# Altium schematic sheet Headstage_withFPGA_BGA.SchDoc
size D
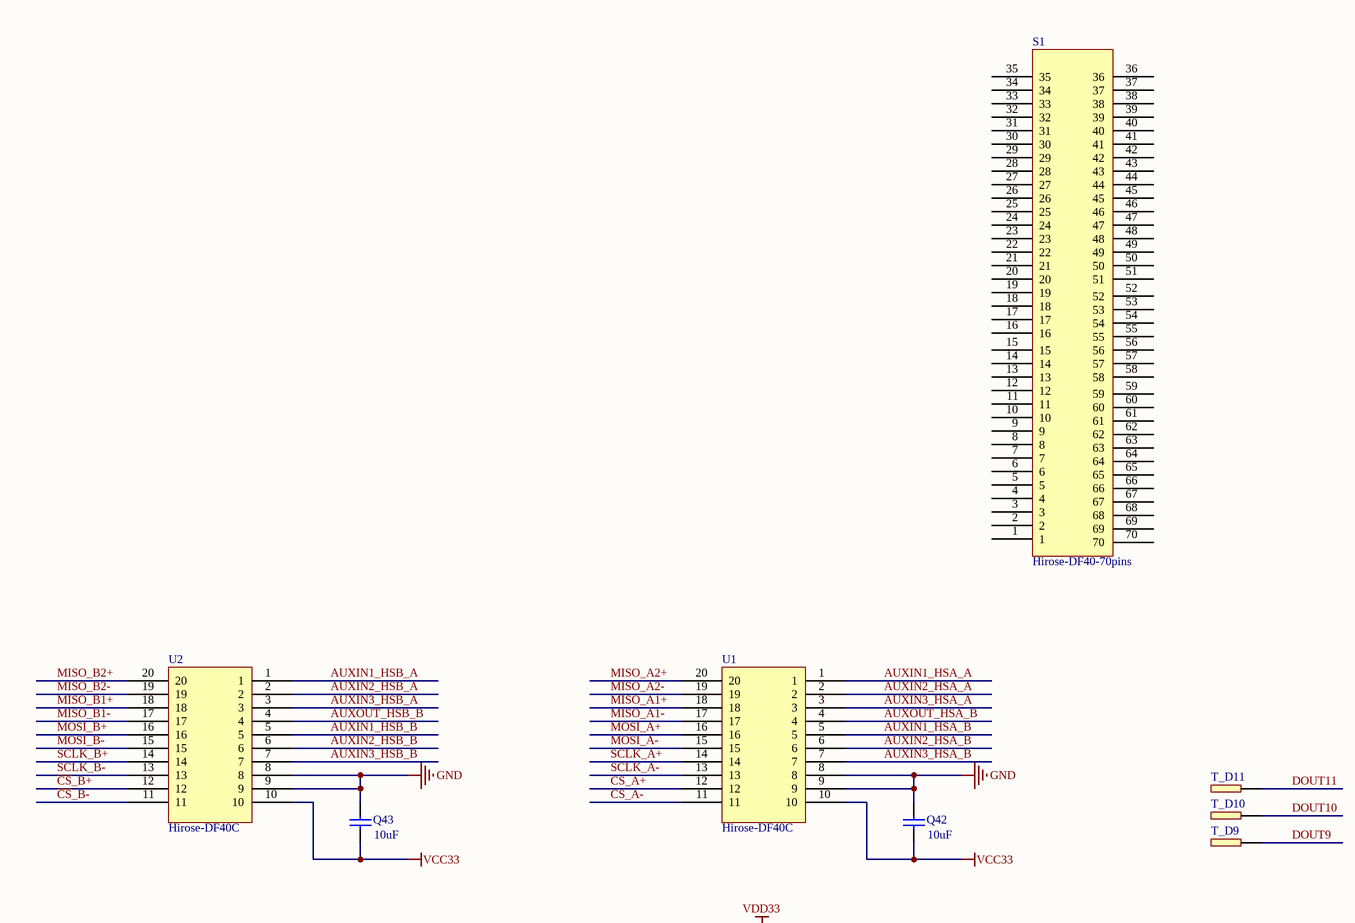
[diagram p0: Headstage_withFPGA_BGA.SchDoc, top left]
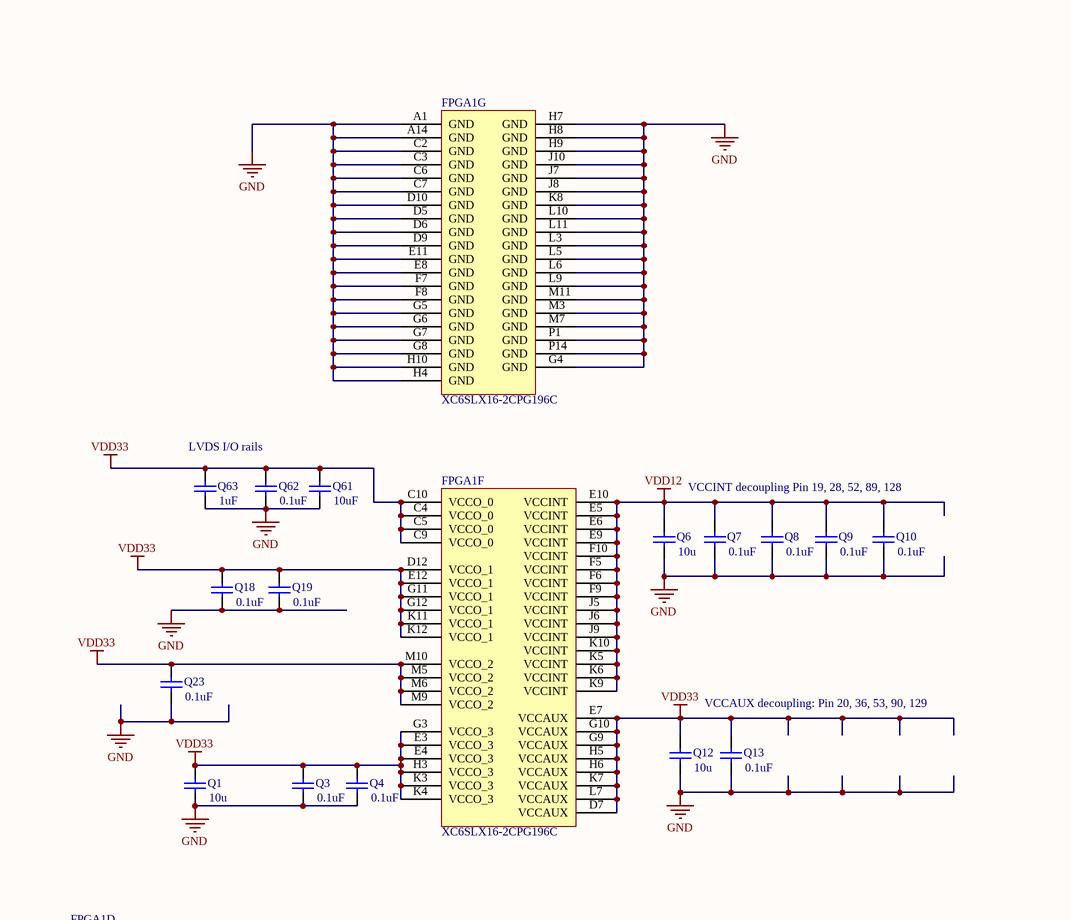
[diagram p1: Headstage_withFPGA_BGA.SchDoc, top right]
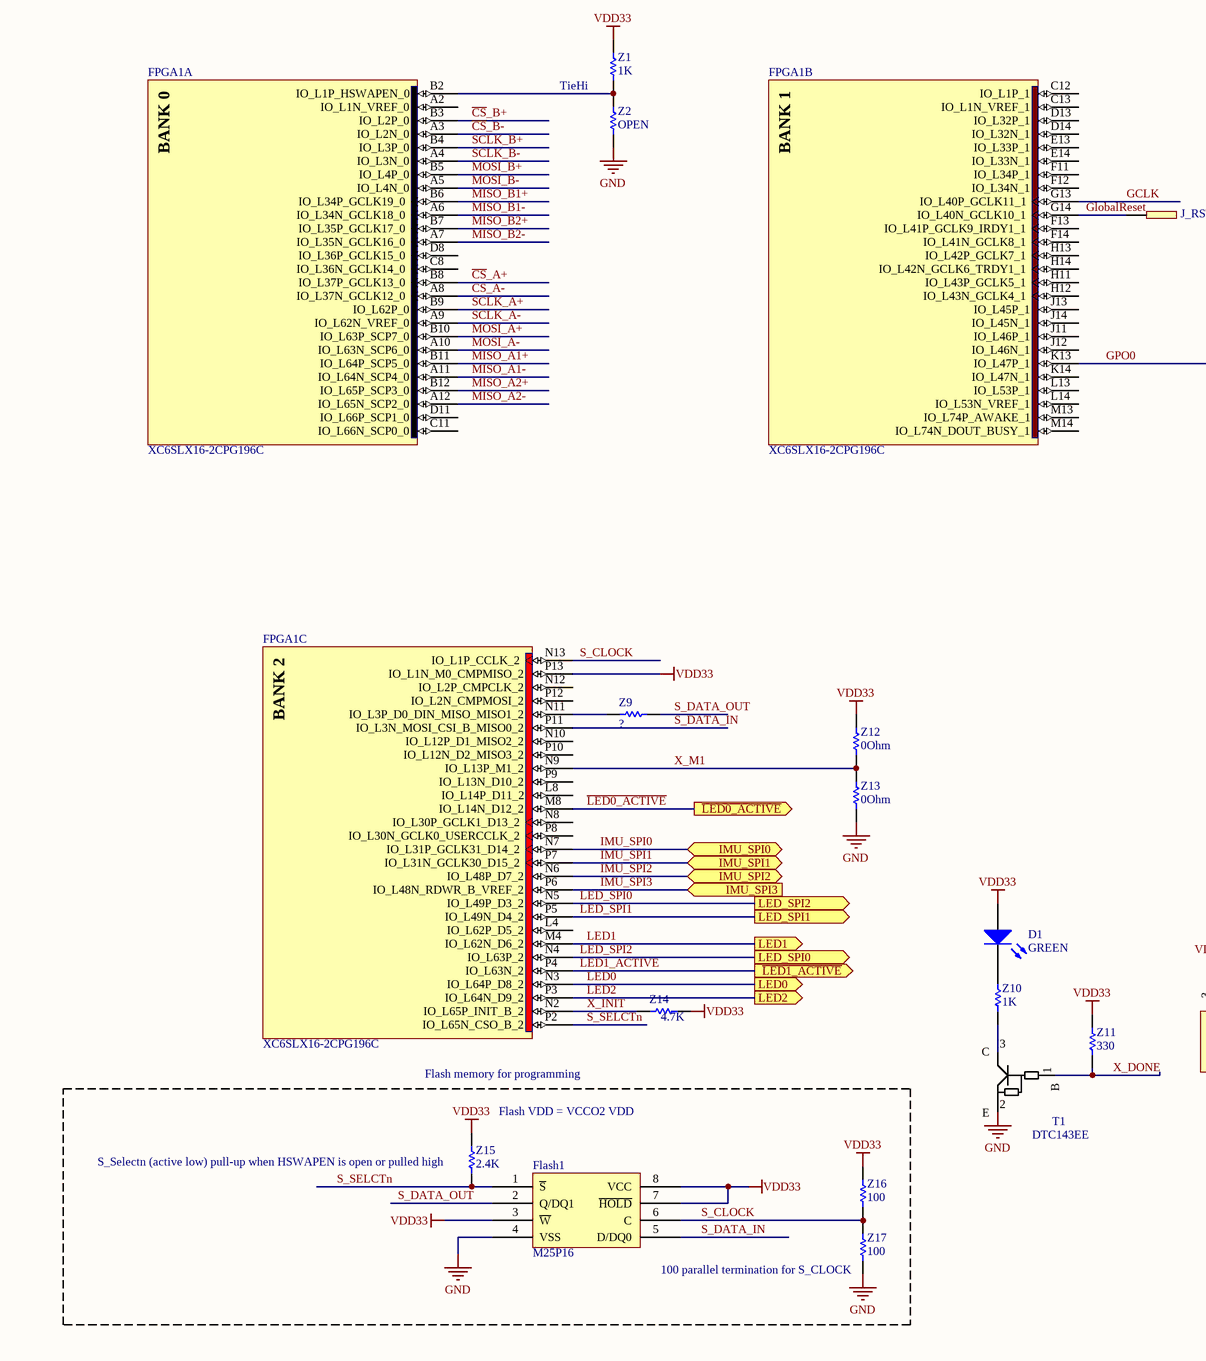
[diagram p2: Headstage_withFPGA_BGA.SchDoc, bottom left]
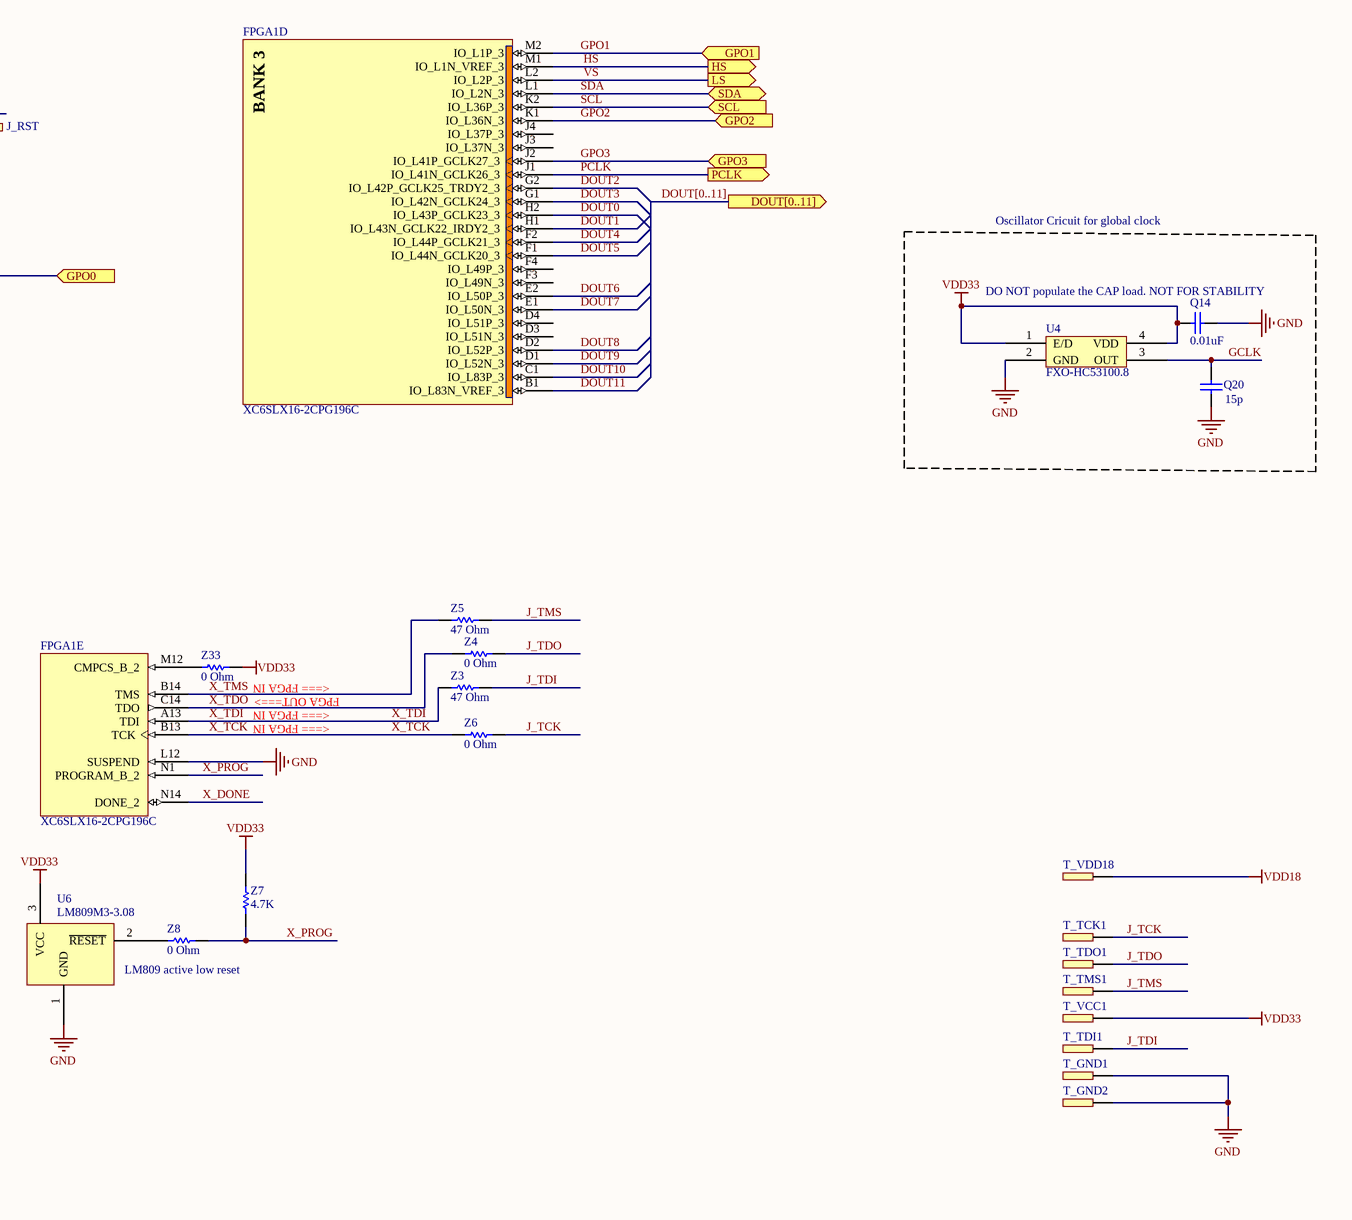
[diagram p3: Headstage_withFPGA_BGA.SchDoc, bottom right]

## Parts
D1  GREEN  [RES_0603]
Flash1  M25P16  [M25P16-S08N]
FPGA1  XC6SLX16-2CPG196C  [CPG196]  (parts A,B,C,D,E,F,G of 7)
J_RST  Header_1PIN  [JUMPER1PIN]  (value not drawn)
Q1  value 10u  [Cap-0603]  (hidden comment: X7R Ceramic)
Q3  value 0.1uF  [Cap_0402]  (hidden comment: X7R Ceramic)
Q4  value 0.1uF  [Cap_0402]  (hidden comment: X7R Ceramic)
Q6  value 10u  [Cap-0603]  (hidden comment: X7R Ceramic)
Q7  value 0.1uF  [Cap_0402]  (hidden comment: X7R Ceramic)
Q8  value 0.1uF  [Cap_0402]  (hidden comment: X7R Ceramic)
Q9  value 0.1uF  [Cap_0402]  (hidden comment: X7R Ceramic)
Q10  value 0.1uF  [Cap_0402]  (hidden comment: X7R Ceramic)
Q12  value 10u  [Cap-0603]  (hidden comment: X7R Ceramic)
Q13  value 0.1uF  [Cap_0402]  (hidden comment: X7R Ceramic)
Q14  value 0.01uF  [Cap_0402]  (hidden comment: X7R Ceramic)
Q18  value 0.1uF  [Cap_0402]  (hidden comment: X7R Ceramic)
Q19  value 0.1uF  [Cap_0402]  (hidden comment: X7R Ceramic)
Q20  value 15p  [Cap-0603]  (hidden comment: X7R Ceramic)
Q23  value 0.1uF  [Cap_0402]  (hidden comment: X7R Ceramic)
Q42  value 10uF  [Cap_0402]  (hidden comment: X7R Ceramic)
Q43  value 10uF  [Cap_0402]  (hidden comment: X7R Ceramic)
Q61  value 10uF  [Cap-0603]  (hidden comment: X7R Ceramic)
Q62  value 0.1uF  [Cap_0402]  (hidden comment: X7R Ceramic)
Q63  value 1uF  [Cap_0402]  (hidden comment: X7R Ceramic)
S1  Hirose-DF40-70pins  [DF40 - 70]
T1  DTC143EE  [VMT3]
T_D9  Header_1PIN  [JUMPER1PIN]  (value not drawn)
T_D10  Header_1PIN  [JUMPER1PIN]  (value not drawn)
T_D11  Header_1PIN  [JUMPER1PIN]  (value not drawn)
T_GND1  Header_1PIN  [JUMPER1PIN]  (value not drawn)
T_GND2  Header_1PIN  [JUMPER1PIN]  (value not drawn)
T_TCK1  Header_1PIN  [JUMPER1PIN]  (value not drawn)
T_TDI1  Header_1PIN  [JUMPER1PIN]  (value not drawn)
T_TDO1  Header_1PIN  [JUMPER1PIN]  (value not drawn)
T_TMS1  Header_1PIN  [JUMPER1PIN]  (value not drawn)
T_VCC1  Header_1PIN  [JUMPER1PIN]  (value not drawn)
T_VDD18  Header_1PIN  [JUMPER1PIN]  (value not drawn)
U1  Hirose-DF40C  [DF40]
U2  Hirose-DF40C  [DF40]
U4  FXO-HC53100.8  [FXO-HC53]
U6  LM809M3-3.08  [SOT23]
Z1  value 1K  [Res_0402]  (hidden comment: Res1)
Z2  value OPEN  [Res_0402]  (hidden comment: Res1)
Z3  value 47 Ohm  [Res_0402]  (hidden comment: Res1)
Z4  value 0 Ohm  [Res_0402]  (hidden comment: Res1)
Z5  value 47 Ohm  [Res_0402]  (hidden comment: Res1)
Z6  value 0 Ohm  [Res_0402]  (hidden comment: Res1)
Z7  value 4.7K  [Res_0402]  (hidden comment: Res1)
Z8  value 0 Ohm  [Res_0402]  (hidden comment: Res1)
Z9  Res1  [Res_0402]  (value not drawn)
Z10  value 1K  [Res_0402]  (hidden comment: Res1)
Z11  value 330  [Res_0402]  (hidden comment: Res1)
Z12  value 0Ohm  [Res_0402]  (hidden comment: Res1)
Z13  value 0Ohm  [Res_0402]  (hidden comment: Res1)
Z14  value 4.7K  [Res_0402]  (hidden comment: Res1)
Z15  value 2.4K  [Res_0402]  (hidden comment: Res1)
Z16  value 100  [Res_0402]  (hidden comment: Res1)
Z17  value 100  [Res_0402]  (hidden comment: Res1)
Z33  value 0 Ohm  [Res_0402]  (hidden comment: Res1)

## Ports
DOUT[0..11] (out), GPO0 (in), GPO1 (in), GPO2 (in), GPO3 (in), HS (out), IMU_SPI0 (bidir), IMU_SPI1 (bidir), IMU_SPI2 (bidir), IMU_SPI3 (in), LED0 (out), LED1 (out), LED2 (out), LED_SPI0 (out), LED_SPI1 (out), LED_SPI2 (out), LS (out), PCLK (out), SCL (in), SDA (bidir), ~{LED0_ACTIVE} (out), ~{LED1_ACTIVE} (out)

## Nets
GND: Flash1.4(VSS) FPGA1.A1(GND) FPGA1.A14(GND) FPGA1.C2(GND) FPGA1.C3(GND) FPGA1.C6(GND) FPGA1.C7(GND) FPGA1.D5(GND) FPGA1.D6(GND) FPGA1.D9(GND) FPGA1.D10(GND) FPGA1.E8(GND) FPGA1.E11(GND) FPGA1.F7(GND) FPGA1.F8(GND) FPGA1.G4(GND) FPGA1.G5(GND) FPGA1.G6(GND) FPGA1.G7(GND) FPGA1.G8(GND) FPGA1.H4(GND) FPGA1.H7(GND) FPGA1.H8(GND) FPGA1.H9(GND) FPGA1.H10(GND) FPGA1.J7(GND) FPGA1.J8(GND) FPGA1.J10(GND) FPGA1.K8(GND) FPGA1.L3(GND) FPGA1.L5(GND) FPGA1.L6(GND) FPGA1.L9(GND) FPGA1.L10(GND) FPGA1.L11(GND) FPGA1.L12(SUSPEND) FPGA1.M3(GND) FPGA1.M7(GND) FPGA1.M11(GND) FPGA1.P1(GND) FPGA1.P14(GND) Q1.1 Q3.1 Q4.1 Q6.1 Q7.1 Q8.1 Q9.1 Q10.1 Q12.1 Q13.1 Q14.1 Q18.1 Q19.1 Q20.1 Q23.1 Q42.2 Q43.2 Q61.1 Q62.1 Q63.1 T1.2(E) T_GND1.0 T_GND2.0 U1.8 U1.9 U2.8 U2.9 U4.2(GND) U6.1(GND) Z2.1 Z13.1 Z17.1
VCC33: Q42.1 Q43.1 U1.10 U2.10
VDD12: FPGA1.E5(VCCINT) FPGA1.E6(VCCINT) FPGA1.E9(VCCINT) FPGA1.E10(VCCINT) FPGA1.F5(VCCINT) FPGA1.F6(VCCINT) FPGA1.F9(VCCINT) FPGA1.F10(VCCINT) FPGA1.J5(VCCINT) FPGA1.J6(VCCINT) FPGA1.J9(VCCINT) FPGA1.K5(VCCINT) FPGA1.K6(VCCINT) FPGA1.K9(VCCINT) FPGA1.K10(VCCINT) Q6.2 Q7.2 Q8.2 Q9.2 Q10.2
VDD18: T_VDD18.0
VDD33: D1.1(A) Flash1.3(~{W}) Flash1.7(~{HOLD}) Flash1.8(VCC) FPGA1.C4(VCCO_0) FPGA1.C5(VCCO_0) FPGA1.C9(VCCO_0) FPGA1.C10(VCCO_0) FPGA1.D7(VCCAUX) FPGA1.D12(VCCO_1) FPGA1.E3(VCCO_3) FPGA1.E4(VCCO_3) FPGA1.E7(VCCAUX) FPGA1.E12(VCCO_1) FPGA1.G3(VCCO_3) FPGA1.G9(VCCAUX) FPGA1.G10(VCCAUX) FPGA1.G11(VCCO_1) FPGA1.G12(VCCO_1) FPGA1.H3(VCCO_3) FPGA1.H5(VCCAUX) FPGA1.H6(VCCAUX) FPGA1.K3(VCCO_3) FPGA1.K4(VCCO_3) FPGA1.K7(VCCAUX) FPGA1.K11(VCCO_1) FPGA1.K12(VCCO_1) FPGA1.L7(VCCAUX) FPGA1.M5(VCCO_2) FPGA1.M6(VCCO_2) FPGA1.M9(VCCO_2) FPGA1.M10(VCCO_2) FPGA1.P13(IO_L1N_M0_CMPMISO_2) Q1.2 Q3.2 Q4.2 Q12.2 Q13.2 Q14.2 Q18.2 Q19.2 Q23.2 Q61.2 Q62.2 Q63.2 T_VCC1.0 U4.1(E/D) U4.4(VDD) U6.3(VCC) Z1.2 Z7.1 Z11.2 Z12.2 Z14.1 Z15.2 Z16.2 Z33.1
AUXIN1_HSA_A: U1.1
AUXIN1_HSA_B: U1.5
AUXIN1_HSB_A: U2.1
AUXIN1_HSB_B: U2.5
AUXIN2_HSA_A: U1.2
AUXIN2_HSA_B: U1.6
AUXIN2_HSB_A: U2.2
AUXIN2_HSB_B: U2.6
AUXIN3_HSA_A: U1.3
AUXIN3_HSA_B: U1.7
AUXIN3_HSB_A: U2.3
AUXIN3_HSB_B: U2.7
AUXOUT_HSA_B: U1.4
AUXOUT_HSB_B: U2.4
~{CS}_A+: FPGA1.B8(IO_L37P_GCLK13_0) U1.12
~{CS}_A-: FPGA1.A8(IO_L37N_GCLK12_0) U1.11
~{CS}_B+: FPGA1.B3(IO_L2P_0) U2.12
~{CS}_B-: FPGA1.A3(IO_L2N_0) U2.11
DOUT0: FPGA1.H2(IO_L43P_GCLK23_3)
DOUT1: FPGA1.H1(IO_L43N_GCLK22_IRDY2_3)
DOUT2: FPGA1.G2(IO_L42P_GCLK25_TRDY2_3)
DOUT3: FPGA1.G1(IO_L42N_GCLK24_3)
DOUT4: FPGA1.F2(IO_L44P_GCLK21_3)
DOUT5: FPGA1.F1(IO_L44N_GCLK20_3)
DOUT6: FPGA1.E2(IO_L50P_3)
DOUT7: FPGA1.E1(IO_L50N_3)
DOUT8: FPGA1.D2(IO_L52P_3)
DOUT9: FPGA1.D1(IO_L52N_3) T_D9.0
DOUT10: FPGA1.C1(IO_L83P_3) T_D10.0
DOUT11: FPGA1.B1(IO_L83N_VREF_3) T_D11.0
GCLK: FPGA1.G13(IO_L40P_GCLK11_1) Q20.2 U4.3(OUT)
GlobalReset: FPGA1.G14(IO_L40N_GCLK10_1) J_RST.0
GPO0: FPGA1.K13(IO_L47P_1) ; port GPO0
GPO1: FPGA1.M2(IO_L1P_3) ; port GPO1
GPO2: FPGA1.K1(IO_L36N_3) ; port GPO2
GPO3: FPGA1.J2(IO_L41P_GCLK27_3) ; port GPO3
HS: FPGA1.M1(IO_L1N_VREF_3) ; port HS
IMU_SPI0: FPGA1.N7(IO_L31P_GCLK31_D14_2) ; port IMU_SPI0
IMU_SPI1: FPGA1.P7(IO_L31N_GCLK30_D15_2) ; port IMU_SPI1
IMU_SPI2: FPGA1.N6(IO_L48P_D7_2) ; port IMU_SPI2
IMU_SPI3: FPGA1.P6(IO_L48N_RDWR_B_VREF_2) ; port IMU_SPI3
J_TCK: T_TCK1.0 Z6.1
J_TDI: T_TDI1.0 Z3.1
J_TDO: T_TDO1.0 Z4.1
J_TMS: T_TMS1.0 Z5.1
~{LED0_ACTIVE}: FPGA1.M8(IO_L14N_D12_2) ; port ~{LED0_ACTIVE}
~{LED1_ACTIVE}: FPGA1.P4(IO_L63N_2) ; port ~{LED1_ACTIVE}
LED0: FPGA1.N3(IO_L64P_D8_2) ; port LED0
LED1: FPGA1.M4(IO_L62N_D6_2) ; port LED1
LED2: FPGA1.P3(IO_L64N_D9_2) ; port LED2
LED_SPI0: FPGA1.N5(IO_L49P_D3_2) ; port LED_SPI2
LED_SPI1: FPGA1.P5(IO_L49N_D4_2) ; port LED_SPI1
LED_SPI2: FPGA1.N4(IO_L63P_2) ; port LED_SPI0
MISO_A1+: FPGA1.B11(IO_L64P_SCP5_0) U1.18
MISO_A1-: FPGA1.A11(IO_L64N_SCP4_0) U1.17
MISO_A2+: FPGA1.B12(IO_L65P_SCP3_0) U1.20
MISO_A2-: FPGA1.A12(IO_L65N_SCP2_0) U1.19
MISO_B1+: FPGA1.B6(IO_L34P_GCLK19_0) U2.18
MISO_B1-: FPGA1.A6(IO_L34N_GCLK18_0) U2.17
MISO_B2+: FPGA1.B7(IO_L35P_GCLK17_0) U2.20
MISO_B2-: FPGA1.A7(IO_L35N_GCLK16_0) U2.19
MOSI_A+: FPGA1.B10(IO_L63P_SCP7_0) U1.16
MOSI_A-: FPGA1.A10(IO_L63N_SCP6_0) U1.15
MOSI_B+: FPGA1.B5(IO_L4P_0) U2.16
MOSI_B-: FPGA1.A5(IO_L4N_0) U2.15
PCLK: FPGA1.J1(IO_L41N_GCLK26_3) ; port PCLK
S_CLOCK: Flash1.6(C) FPGA1.N13(IO_L1P_CCLK_2) Z16.1 Z17.2
S_DATA_IN: Flash1.5(D/DQ0) FPGA1.P11(IO_L3N_MOSI_CSI_B_MISO0_2)
S_DATA_OUT: Flash1.2(Q/DQ1) Z9.1
S_SELCTn: Flash1.1(~{S}) FPGA1.P2(IO_L65N_CSO_B_2) Z15.1
SCL: FPGA1.K2(IO_L36P_3) ; port SCL
SCLK_A+: FPGA1.B9(IO_L62P_0) U1.14
SCLK_A-: FPGA1.A9(IO_L62N_VREF_0) U1.13
SCLK_B+: FPGA1.B4(IO_L3P_0) U2.14
SCLK_B-: FPGA1.A4(IO_L3N_0) U2.13
SDA: FPGA1.L1(IO_L2N_3) ; port SDA
VS: FPGA1.L2(IO_L2P_3) ; port LS
X_DONE: FPGA1.N14(DONE_2) T1.1(B) Z11.1
X_INIT: FPGA1.N2(IO_L65P_INIT_B_2) Z14.2
X_M1: FPGA1.N9(IO_L13P_M1_2) Z12.1 Z13.2
X_PROG: FPGA1.N1(PROGRAM_B_2) Z7.2 Z8.1
X_TCK: FPGA1.B13(TCK) Z6.2
X_TDI: FPGA1.A13(TDI) Z3.2
X_TDO: FPGA1.C14(TDO) Z4.2
X_TMS: FPGA1.B14(TMS) Z5.2
NetD1_2: D1.2(K) Z10.2
NetFPGA1_B2: FPGA1.B2(IO_L1P_HSWAPEN_0) Z1.1 Z2.2
NetFPGA1_M12: FPGA1.M12(CMPCS_B_2) Z33.2
NetFPGA1_N11: FPGA1.N11(IO_L3P_D0_DIN_MISO_MISO1_2) Z9.2
NetT1_3: T1.3(C) Z10.1
NetU6_2: U6.2(~{RESET}) Z8.2

Not connected (* = marked no-connect by the designer): FPGA1 A2(IO_L1N_VREF_0) C8(IO_L36N_GCLK14_0) C11(IO_L66N_SCP0_0) C12(IO_L1P_1) C13(IO_L1N_VREF_1) D3(IO_L51N_3) D4(IO_L51P_3) D8(IO_L36P_GCLK15_0) D11(IO_L66P_SCP1_0) D13(IO_L32P_1) D14(IO_L32N_1) E13(IO_L33P_1) E14(IO_L33N_1) F3(IO_L49N_3) F4(IO_L49P_3) F11(IO_L34P_1) F12(IO_L34N_1) F13(IO_L41P_GCLK9_IRDY1_1) F14(IO_L41N_GCLK8_1) H11(IO_L43P_GCLK5_1) H12(IO_L43N_GCLK4_1) H13(IO_L42P_GCLK7_1) H14(IO_L42N_GCLK6_TRDY1_1) J3(IO_L37N_3) J4(IO_L37P_3) J11(IO_L46P_1) J12(IO_L46N_1) J13(IO_L45P_1) J14(IO_L45N_1) K14(IO_L47N_1) L4(IO_L62P_D5_2) L8(IO_L14P_D11_2) L13(IO_L53P_1) L14(IO_L53N_VREF_1) M13(IO_L74P_AWAKE_1) M14(IO_L74N_DOUT_BUSY_1) N8(IO_L30P_GCLK1_D13_2) N10(IO_L12P_D1_MISO2_2) N12(IO_L2P_CMPCLK_2) P8(IO_L30N_GCLK0_USERCCLK_2) P9(IO_L13N_D10_2) P10(IO_L12N_D2_MISO3_2) P12(IO_L2N_CMPMOSI_2); S1 1 2 3 4 5 6 7 8 9 10 11 12 13 14 15 16 17 18 19 20 21 22 23 24 25 26 27 28 29 30 31 32 33 34 35 36 37 38 39 40 41 42 43 44 45 46 47 48 49 50 51 52 53 54 55 56 57 58 59 60 61 62 63 64 65 66 67 68 69 70

## Buses and harness runs
bus DOUT[0..11] = port DOUT[0..11]

## Notes on the sheet
- LVDS I/O rails
- VCCINT decoupling Pin 19, 28, 52, 89, 128
- VCCAUX decoupling: Pin 20, 36, 53, 90, 129
- TieHi
- Oscillator Cricuit for global clock
- (near Q14) DO NOT populate the CAP load. NOT FOR STABILITY
- (near Z33) <=== FPGA IN
- <=== FPGA IN
- (near Z33) FPGA OUT===>
- Flash memory for programming
- (near U6) LM809 active low reset
- (near Z15) Flash VDD = VCCO2 VDD
- (near Z15) S_Selectn (active low) pull-up when HSWAPEN is open or pulled high
- (near Z17) 100 parallel termination for S_CLOCK
- (in symbol XC6SLX16-2CPG196C, part A) BANK 0
- (in symbol XC6SLX16-2CPG196C, part B) BANK 1
- (in symbol XC6SLX16-2CPG196C, part C) BANK 2
- (in symbol XC6SLX16-2CPG196C, part D) BANK 3

## Library data of the parts
D1 = LED3: Typical BLUE SiC LED; Published: 8-Jun-2000; LatestRevisionDate: 17-Dec-2003; LatestRevisionNote: PCB Footprint replaced.; DatasheetVersion: 16-Apr-2002; PackageVersion: 16-Apr-2002; PackageReference: 3.5X2.8X1.9; Publisher: Altium Limited; PackageDescription: SM LED; 2 C-Bend Leads; Body 3.5 x 2.8 x 1.9 mm, inc leads (LxWxH typ)
FPGA1 = XC6SLX16-2CPG196C: Spartan-6 LX 1.2V FPGA, 106 User I/Os, 196-Ball Chip-Scale BGA (0.5mm Pitch), Speed Grade 2, Commercial Grade, Pb-Free; DatasheetVersion: ver1.6, Nov-2010; PackageVersion: ver1.0, Dec-2009; PackageReference: CPG196; PackageDescription: 196-Ball Chip Scale Ball Grid Array 0.5 mm Pitch (CPG196) - Pb-Free; Code_JEDEC: MO-275; ComponentLink1Description: Manufacturer URL; ComponentLink1URL: http://www.xilinx.com/; ComponentLink2Description: Spartan-6 Datasheet; ComponentLink2URL: http://www.xilinx.com/support/documentation/data_sheets/ds160.pdf; ComponentLink3Description: Spartan-6 Documents; ComponentLink3URL: http://www.xilinx.com/support/documentation/spartan-6.htm
Q1 Q3 Q4 Q6-Q10 Q12-Q14 Q18-Q20 Q23 Q42 Q43 Q61-Q63 = Cap: Capacitor; Published: 8-Jun-2000; LatestRevisionDate: 17-Jul-2002; LatestRevisionNote: Re-released for DXP Platform.; PackageReference: RAD-0.3; Publisher: Altium Limited; PackageDescription: Radial Cap, Thru-Hole; 2 Leads; 0.3 in Pin Spacing
Z1-Z17 Z33 = Res1: Resistor; Published: 8-Jun-2000; LatestRevisionDate: 17-Jul-2002; LatestRevisionNote: Re-released for DXP Platform.; PackageReference: AXIAL-0.3; Publisher: Altium Limited; PackageDescription: Axial Device, Thru-Hole; 2 Leads; 0.3 in Pin Spacing
  Z9: Value: ?